# Altium schematic sheet 16-POWER MANAGEMENT.SchDoc
size 513 x 386 mm
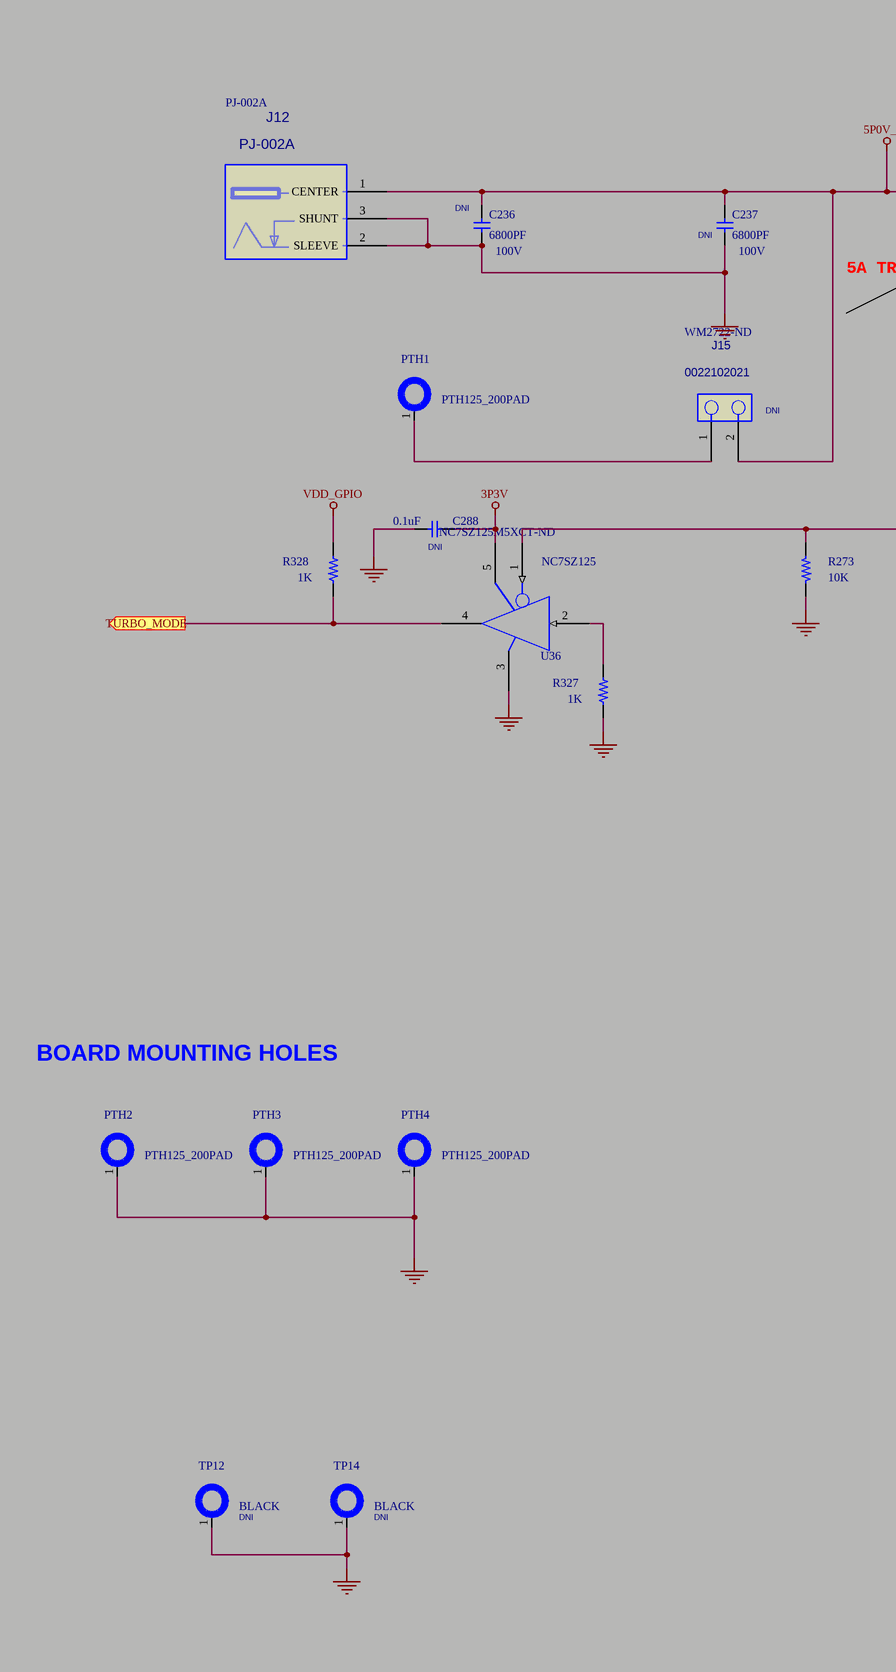
[diagram p0: 16-POWER MANAGEMENT.SchDoc, left]
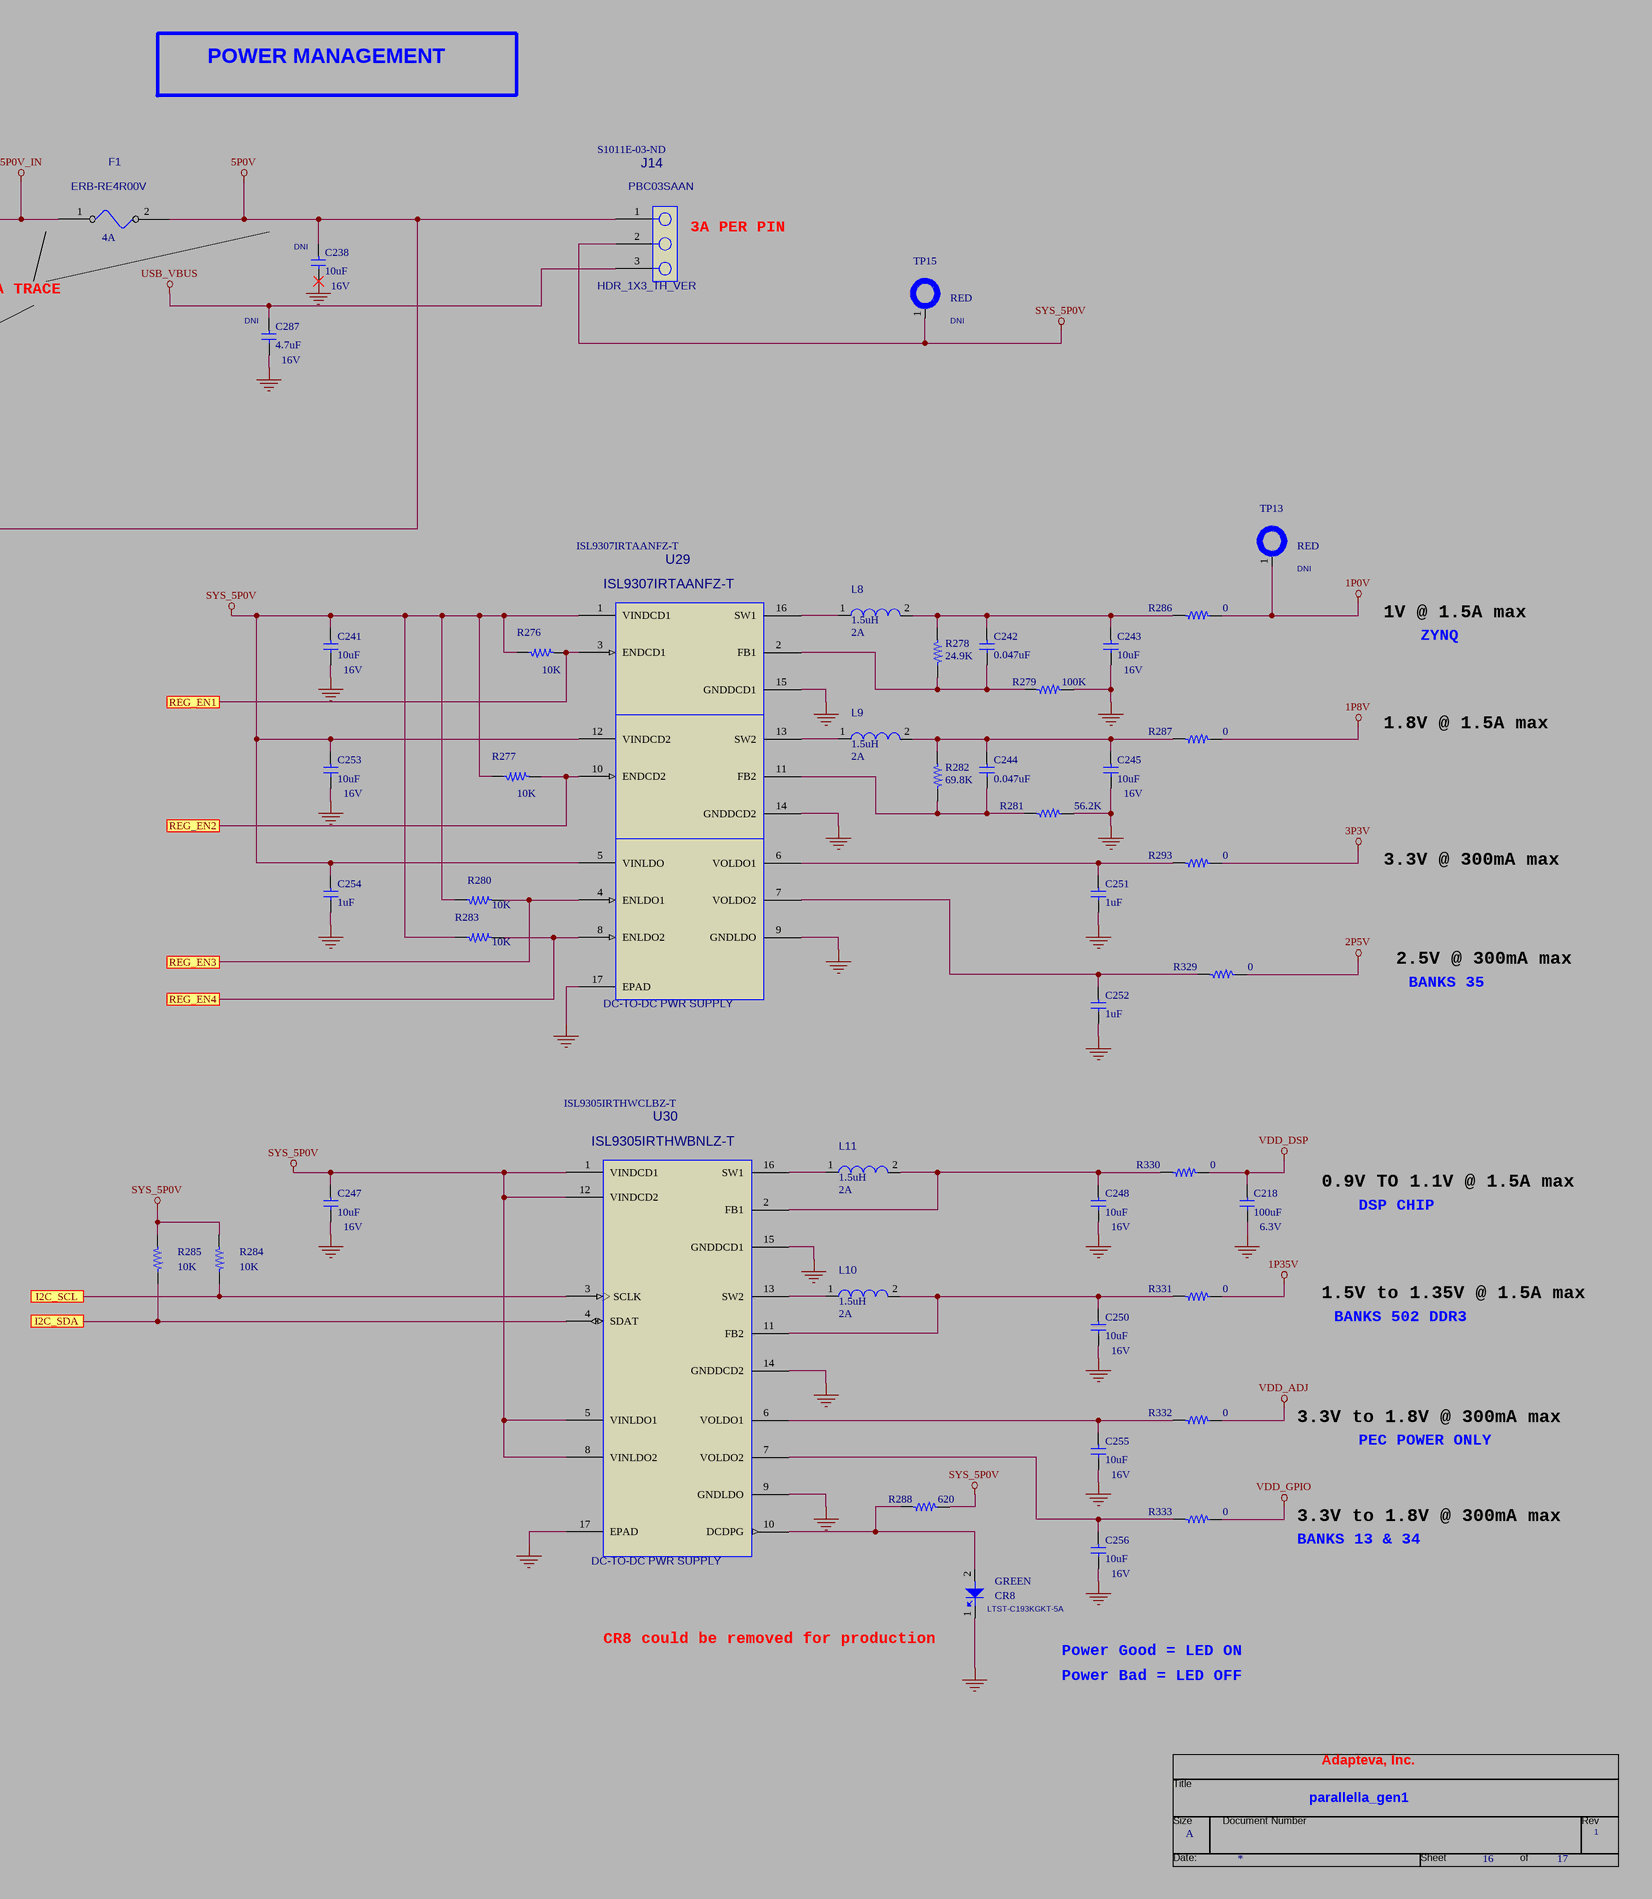
[diagram p1: 16-POWER MANAGEMENT.SchDoc, right]

## Parts
*  RevCode: 1  Title: parallella_gen1  Page Size: A  Page Number: 16  Page Count: 17  OrgAddr1: Adapteva, Inc.  (hidden comment: TitleBlock0)  (graphical)
C218  100uF  VOLTAGE: 6.3V  [C1210]
C236  6800PF  VOLTAGE: 100V  INSTALL: DNI  [C0805]
C237  6800PF  VOLTAGE: 100V  INSTALL: DNI  [C0805]
C238  10uF  VOLTAGE: 16V  INSTALL: DNI  [C0805]
C241  10uF  VOLTAGE: 16V  [C0805]
C242  0.047uF  [C0402]
C243  10uF  VOLTAGE: 16V  [C0805]
C244  0.047uF  [C0402]
C245  10uF  VOLTAGE: 16V  [C0805]
C247  10uF  VOLTAGE: 16V  [C0805]
C248  10uF  VOLTAGE: 16V  [C0805]
C250  10uF  VOLTAGE: 16V  [C0805]
C251  1uF  [C0603]
C252  1uF  [C0603]
C253  10uF  VOLTAGE: 16V  [C0805]
C254  1uF  [C0603]
C255  10uF  VOLTAGE: 16V  [C0805]
C256  10uF  VOLTAGE: 16V  [C0805]
C287  4.7uF  VOLTAGE: 16V  INSTALL: DNI  [C0603]
C288  0.1uF  INSTALL: DNI  [C0402]
CR8  GREEN  Vendor PN: LTST-C193KGKT-5A  [LED_0603]
F1  4A  Vendor PN: ERB-RE4R00V  [F0603]
J12  PJ-002A  [DC_PWR_JCK_9X14P4X11MMH]
J14  HDR_1X3_TH_VER  Vendor PN: PBC03SAAN  Supplier Part Number 1: S1011E-03-ND  [HDR_1X3_TH_VER]
J15  Vendor PN: 0022102021  INSTALL: DNI  Supplier Part Number 1: WM2722-ND  [HDR_1X2_TH_VER]  (hidden comment: HDR_1X2_TH_VER)
L8  1.5uH  CURRENT: 2A  [IND2_2X2P5X1P2MMH]
L9  1.5uH  CURRENT: 2A  [IND2_2X2P5X1P2MMH]
L10  1.5uH  CURRENT: 2A  [IND2_2X2P5X1P2MMH]
L11  1.5uH  CURRENT: 2A  [IND2_2X2P5X1P2MMH]
PTH1  PTH125_200PAD  [PTH125_200PAD]
PTH2  PTH125_200PAD  [PTH125_200PAD]
PTH3  PTH125_200PAD  [PTH125_200PAD]
PTH4  PTH125_200PAD  [PTH125_200PAD]
R273  10K  [R0402]
R276  10K  [R0402]
R277  10K  [R0402]
R278  24.9K  [R0603]
R279  100K  [R0603]
R280  10K  [R0402]
R281  56.2K  [R0402]
R282  69.8K  [R0603]
R283  10K  [R0402]
R284  10K  [R0402]
R285  10K  [R0402]
R286  0  [R0402]
R287  0  [R0402]
R288  620  [R0402]
R293  0  [R0402]
R327  1K  [R0402]
R328  1K  [R0402]
R329  0  [R0402]
R330  0  [R0402]
R331  0  [R0402]
R332  0  [R0402]
R333  0  [R0402]
TP12  BLACK  INSTALL: DNI  [TP55]
TP13  RED  INSTALL: DNI  [TP55]
TP14  BLACK  INSTALL: DNI  [TP55]
TP15  RED  INSTALL: DNI  [TP55]
U29  DC-TO-DC PWR SUPPLY  Vendor PN: ISL9307IRTAANFZ-T  [TQFN16_4SQXP75H_P65P]
U30  DC-TO-DC PWR SUPPLY  Vendor PN: ISL9305IRTHWBNLZ-T  Supplier Part Number 1: ISL9305IRTHWCLBZ-T  [TQFN16_4SQXP75H_P65P]
U36  NC7SZ125  Supplier Part Number 1: NC7SZ125M5XCT-ND  [SOT_5PIN]

## Ports
I2C_SCL, I2C_SDA, REG_EN1, REG_EN2, REG_EN3, REG_EN4, TURBO_MODE (out)

## Nets
1P0V: R286.2 TP13.1
1P8V: R287.2
1P35V: R331.2
2P5V: R329.2
3P3V: C288.2 R293.2 U36.5(VCC)
5P0V: C238.1 F1.2 J14.1 R273.1 U36.1(~{OE})
5P0V_IN: C236.1 C237.1 F1.1 J12.1(CENTER) J15.2
GND: C218.2 C236.2 C237.2 C238.2 C241.2 C243.2 C245.2 C247.2 C248.2 C250.2 C251.2 C252.2 C253.2 C254.2 C255.2 C256.2 C287.2 C288.1 CR8.1(C) J12.2(SLEEVE) J12.3(SHUNT) PTH2.1 PTH3.1 PTH4.1 R273.2 R279.2 R281.2 R327.2 TP12.1 TP14.1 U29.9(GNDLDO) U29.14(GNDDCD2) U29.15(GNDDCD1) U29.17(EPAD) U30.9(GNDLDO) U30.14(GNDDCD2) U30.15(GNDDCD1) U30.17(EPAD) U36.3(GND)
SYS_5P0V: C241.1 C247.1 C253.1 C254.1 J14.2 R276.2 R277.2 R280.2 R283.2 R284.1 R285.1 R288.2 TP15.1 U29.1(VINDCD1) U29.5(VINLDO) U29.12(VINDCD2) U30.1(VINDCD1) U30.5(VINLDO1) U30.8(VINLDO2) U30.12(VINDCD2)
USB_VBUS: C287.1 J14.3
VDD_ADJ: R332.2
VDD_DSP: C218.1 R330.2
VDD_GPIO: R328.1 R333.2
I2C_SCL: R284.2 U30.3(SCLK) ; port I2C_SCL
I2C_SDA: R285.2 U30.4(SDAT) ; port I2C_SDA
REG_EN1: R276.1 U29.3(ENDCD1) ; port REG_EN1
REG_EN2: R277.1 U29.10(ENDCD2) ; port REG_EN2
REG_EN3: R280.1 U29.4(ENLDO1) ; port REG_EN3
REG_EN4: R283.1 U29.8(ENLDO2) ; port REG_EN4
TURBO_MODE: R328.2 U36.4(Y) ; port TURBO_MODE
NetC242_1: C242.1 C243.1 L8.2 R278.1 R286.1
NetC242_2: C242.2 R278.2 R279.1 U29.2(FB1)
NetC244_1: C244.1 C245.1 L9.2 R282.1 R287.1
NetC244_2: C244.2 R281.1 R282.2 U29.11(FB2)
NetC248_1: C248.1 L11.2 R330.1 U30.2(FB1)
NetC250_1: C250.1 L10.2 R331.1 U30.11(FB2)
NetC251_1: C251.1 R293.1 U29.6(VOLDO1)
NetC252_1: C252.1 R329.1 U29.7(VOLDO2)
NetC255_1: C255.1 R332.1 U30.6(VOLDO1)
NetC256_1: C256.1 R333.1 U30.7(VOLDO2)
NetCR8_2: CR8.2(A) R288.1 U30.10(DCDPG)
NetJ15_1: J15.1 PTH1.1
NetL8_1: L8.1 U29.16(SW1)
NetL9_1: L9.1 U29.13(SW2)
NetL10_1: L10.1 U30.13(SW2)
NetL11_1: L11.1 U30.16(SW1)
NetR327_1: R327.1 U36.2(A)

## Notes on the sheet
- POWER MANAGEMENT
- (near J14) 3A PER PIN
- 5A TRACE
- 1V @ 1.5A max
- ZYNQ
- 1.8V @ 1.5A max
- 3.3V @ 300mA max
- 2.5V @ 300mA max
- BOARD MOUNTING HOLES
- BANKS 35
- 0.9V TO 1.1V @ 1.5A max
- DSP CHIP
- 1.5V to 1.35V @ 1.5A max
- BANKS 502 DDR3
- 3.3V to 1.8V @ 300mA max
- PEC POWER ONLY
- BANKS 13 & 34
- CR8 could be removed for production
- Power Good = LED ON
- Power Bad = LED OFF
- (in symbol TitleBlock0) Title; Size; Document Number; Rev; Date:; Sheet; of

## Library data of the parts
C218 = CAP1210_100UF_X5R_LOESR: CAP, 1210, 100UF, X5R, 6.3V, LOW ESR; MFG PART NO: GRM32ER60J107ME20L; MFG: MURATA; DEVICE: CAP1210_100UF_X5R_LOESR; Vendor: MURATA; Vendor PN: GRM32ER60J107ME20L; PCB Footprint: C1210
C236 C237 = CAP0805_6800PF_X7R: CAP, 0805, 6800PF, X7R, 100V; MFG PART NO: C2012X7R2A682KT5; MFG: TDK; DEVICE: CAP0805_6800PF_X7R; Vendor: TDK; Vendor PN: C2012X7R2A682KT5; PCB Footprint: C0805
C238 C241 C243 C245 C247 C248 C250 C253 C255 C256 = CAP0805_10UF_16V_X5R: CAP, 0805, 10UF, X5R, 16V; MFG PART NO: C2012X5R1C106M085AC; MFG: TDK; DEVICE: CAP0805_10UF_16V_X5R; Vendor: TDK; Vendor PN: C2012X5R1C106M085AC; PCB Footprint: C0805
C242 C244 = CAP0402_0P047UF_X5R: CAP, 0402, 0.047UF, X5R, 25V; MFG PART NO: C1005X5R1E473M; MFG: TDK; DEVICE: CAP0402_0P047UF_X5R; Vendor: TDK; Vendor PN: C1005X5R1E473M; PCB Footprint: C0402
C251 C252 C254 = CAP1UF_X5R: CAP, 0603, 1UF, X5R, 16V; Vendor PN: C0603C105K4PAC; Vendor: KEMET; DEVICE: CAP0603; MFG PART NO: C0603C105K4PAC; MFG: KEMET; PCB Footprint: C0603
C287 = CAP0603_4P7UF_16V_X5R: CAP, 0603, 4.7UF, X5R, 16V; MFG PART NO: C1608X5R1C475K080AC; MFG: TDK; DEVICE: CAP0603_4P7UF_16V_X5R; Vendor: TDK; Vendor PN: C1608X5R1C475K080AC; PCB Footprint: C0603
C288 = CAP0402_0P1UF_X5R_35V: CAP, 0402, 0.1UF, X5R, 35V; ALT_SYMBOLS: C0402_BGA; Vendor PN: GMK105BJ104KV-F; Vendor: TAIYO YUDEN; DEVICE: CAP0402_0P1UF_X5R_35V; MFG PART NO: GMK105BJ104KV-F; MFG: TAIYO YUDEN; PCB Footprint: C0402
CR8 = LED_0603_5MA_GRN: LED, 0603, 5MA, SMT, GREEN; Voltage: 2V; MFG: LITE-ON INC; MFG PART NO: LTST-C193KGKT-5A; Vendor: LITE-ON INC; PCB Footprint: LED_0603
F1 = FUSE0603_4A: FUSE, 4A, 32V, FAST, 0603; Vendor: PANASONIC; MFG PART NO: ERB-RE4R00V; MFG: PANASONIC; DEVICE: FUSE0603_4A; PCB Footprint: F0603
J12 = CON_POWER_PJ002A_TH: CON, PWR, BARREL, PCB, PJ002A_TH; Vendor: CUI; DEVICE: CON_POWER_PJ002A_TH; Vendor PN: PJ-002A; PCB Footprint: DC_PWR_JCK_9X14P4X11MMH; Supplier 1: Arrow; Supplier Part Number 1: PJ-002A
J14 = HDR_1X3_TH_VER_0.1P: HDR, 1ROW, 3POS, VERT, TH, 1X3, 0.100 PITCH; MFG PART NO: PBC36SAAN; Vendor: SULLINS; MFG: SULLINS; DEVICE: HDR_1X3_TH_VER_0.1P; PCB Footprint: HDR_1X3_TH_VER; Supplier 1: Digi-Key
J15 = HDR_1X2_TH_VER: HDR, 1ROW, 2POS, VERT, TH, 1X2; MFG: MOLEX; DEVICE: HDR_1X2_TH_VER; MFG PART NO: 0022102021; Vendor: MOLEX; PCB Footprint: HDR_1X2_TH_VER; Supplier 1: Digi-Key
L8-L11 = IND_1P5UH_2A: IND, 1.5uH, 2A; MFG PART NO: VLS252012ET-1R5N; MFG: TDK; DEVICE: IND_1P5UH_2A; Vendor: TDK; Vendor PN: VLS252012ET-1R5N; PCB Footprint: IND2_2X2P5X1P2MMH
R273 R276 R277 R280 R283-R285 = RES0402_10K: RES, 0402, 10K; MFG PART NO: CRCW040210K0FKED; ALT_SYMBOLS: R0402_BGA; MFG: VISHAY; Vendor: VISHAY/DALE; DEVICE: RES0402_10K; Vendor PN: CRCW040210K0FKED; PCB Footprint: R0402
R278 = RES0603_24K9: RES, 0603, 24.9K; Vendor PN: CRCW060324K9FKEA; Vendor: VISHAY/DALE; MFG PART NO: CRCW060324K9FKEA; MFG: VISHAY/DALE; DEVICE: RES0603_24K9; PCB Footprint: R0603
R279 = RES0603_100K: RES, 0603, 100K; Vendor PN: CRCW0603100KFKEA; Vendor: VISHAY/DALE; MFG: VISHAY/DALE; MFG PART NO: CRCW0603100KFKEA; DEVICE: RES0603_100K; PCB Footprint: R0603
R281 = RES0402_56K2: RES, 0402, 56.2K; Vendor PN: CRCW040256K2FKED; Vendor: VISHAY/DALE; MFG: VISHAY; ALY_SYMBOLS: R0402_BGA; MFG PART NO: CRCW040256K2FKED; DEVICE: RES0402_56K2; PCB Footprint: R0402
R282 = RES0603_69K8: RES, 0603, 69.8K; MFG PART NO: CRCW060369K8FKEA; MFG: VISHAY; DEVICE: RES0603_69K8; Vendor: VISHAY; Vendor PN: CRCW060369K8FKEA; PCB Footprint: R0603
R286 R287 R293 R329-R333 = RES0402_0: RES, 0402, 0 OHM, 1%; MFG PART NO: CRCW04020000Z0ED; ALT_SYMBOLS: R0402_BGA; MFG: VISHAY; Vendor: VISHAY/DALE; DEVICE: RES0402_0; Vendor PN: CRCW04020000Z0ED; PCB Footprint: R0402
R288 = RES0402_620: RES, 0402, 620, 1%; MFG PART NO: CRCW0402620RFKED; ALT_SYMBOLS: R0402_BGA; MFG: VISHAY; Vendor: VISHAY/DALE; DEVICE: RES0402_620; Vendor PN: CRCW0402620RFKED; PCB Footprint: R0402
R327 R328 = RES0402_1K: RES, 0402, 1K; MFG PART NO: CRCW04021K00FKED; ALT_SYMBOLS: R0402_BGA; MFG: VISHAY; Vendor: VISHAY/DALE; DEVICE: RES0402_1K; Vendor PN: CRCW04021K00FKED; PCB Footprint: R0402
TP12 TP14 = TEST_TERM_BLK: PC Test Point Miniature; Vendor PN: 5001; Vendor: Keystone; CLASS: IC; DEVICE: TEST_TERM_BLK; MFG: KEYSTONE; MFG PART NO: 5001; PCB Footprint: TP55
TP13 TP15 = TEST_TERM_RED: PC TEST POINT MINIATURE; MFG PART NO: 5000; MFG: KEYSTONE; CLASS: IC; DEVICE: TEST_TERM_RED; Vendor: KEYSTONE; Vendor PN: 5000; PCB Footprint: TP55
U29 = IC_ISL9307_DCDC_CONV: IC, dual step-down converters + dual LDOs, TQFN16; MFG: INTERSIL; MFG PART NO: ISL9307IRTAANFZ-T; Vendor: INTERSIL; DEVICE: IC_ISL9307_DCDC_CONV; PCB Footprint: TQFN16_4SQXP75H_P65P; Supplier 1: Avnet; Supplier Part Number 1: ISL9307IRTAANFZ-T
U30 = IC_ISL9305_DCDC_CONV: IC, dual step-down converters + dual LDOs, I2C interface, TQFN16; MFG: INTERSIL; MFG PART NO: ISL9305IRTHWCLBZ-T; Vendor: INTERSIL; DEVICE: IC_ISL9305_DCDC_CONV; PCB Footprint: TQFN16_4SQXP75H_P65P; Supplier 1: Avnet
U36 = NC7SZ125: PART_NUMBER: XXX-XXXXX-XX; Vendor PN: NC7SZ125M5X; VENDOR: FAIRCHILD; CLASS: IC; VENDOR_PN: NC7SZ125M5X; DEVICE: NC7SZ125; MFG: FAIRCHILD; MFG PART NO: NC7SZ125M5X; PCB Footprint: SOT_5PIN; Supplier 1: Digi-Key
* = TitleBlock0: Page Create Date: March  8, 1995; Page Modify Date: *
PTH1-PTH4 = PTH125_200PAD: DEVICE: PTH125_200PAD; PCB Footprint: PTH125_200PAD